# EAGLE design I2C_MUX (EAGLE 8.5.2)
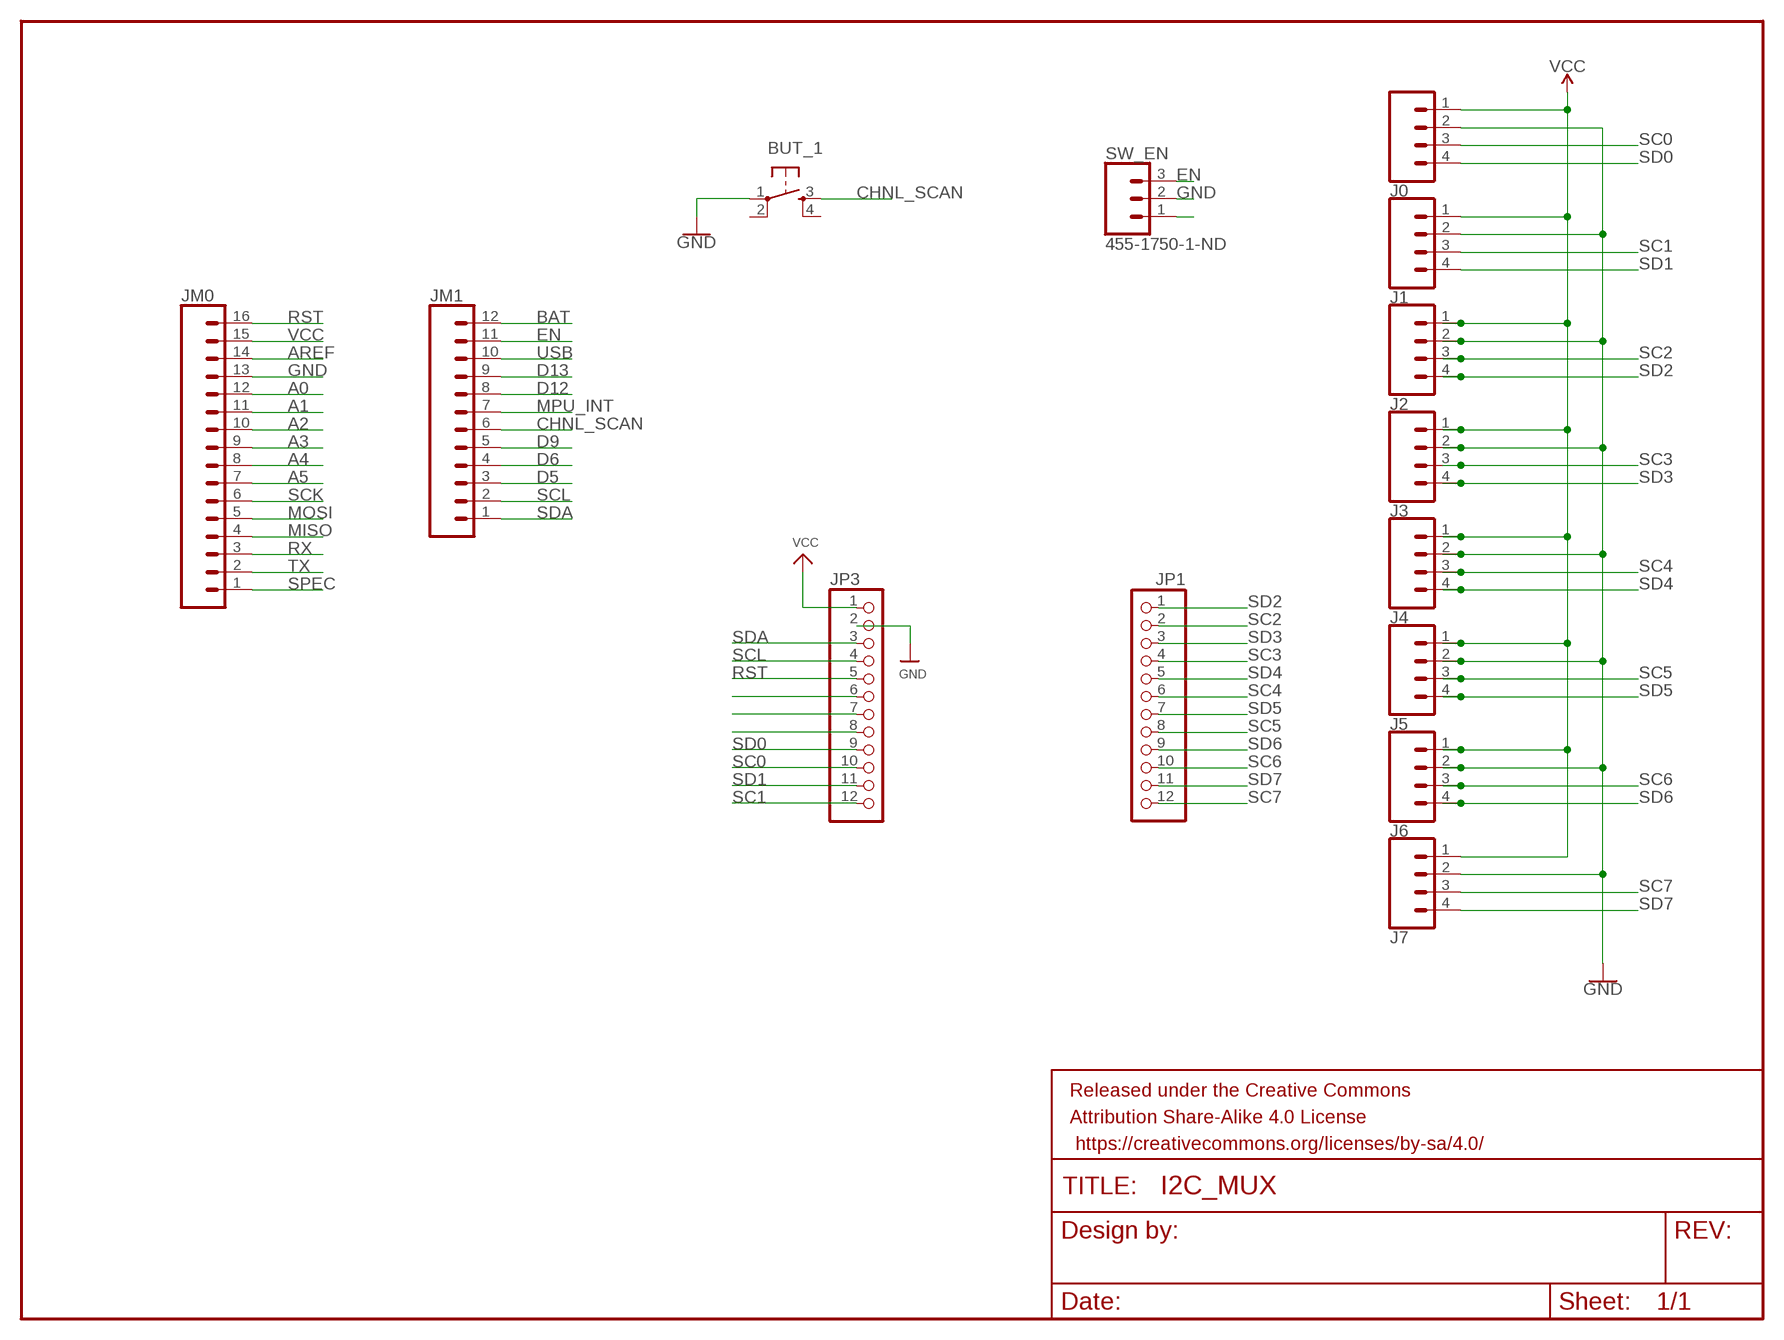
[diagram p0: schematic, sheet 1]

## Parts
BUT_1  TAC_SWITCHPTH  [TACTILE-PTH]
FRAME1  FRAME-LETTER  [CREATIVE_COMMONS]
J0  CONN_04POLAR  [MOLEX-1X4]
J1  CONN_04POLAR  [MOLEX-1X4]
J2  CONN_04POLAR  [MOLEX-1X4]
J3  CONN_04POLAR  [MOLEX-1X4]
J4  CONN_04POLAR  [MOLEX-1X4]
J5  CONN_04POLAR  [MOLEX-1X4]
J6  CONN_04POLAR  [MOLEX-1X4]
J7  CONN_04POLAR  [MOLEX-1X4]
JM0  CONN_16  [1X16]
JM1  CONN_12  [1X12]
JP1  HEADER-1X12  [1X12_ROUND]
JP3  HEADER-1X12  [1X12_ROUND]
SW_EN  455-1750-1-ND  CONN_03  [1X03]

## Nets
A0: JM0.12
A1: JM0.11
A2: JM0.10
A3: JM0.9
A4: JM0.8
A5: JM0.7
AREF: JM0.14
BAT: JM1.12
CHNL_SCAN: BUT_1.3 JM1.6
D5: JM1.3
D6: JM1.4
D9: JM1.5
D12: JM1.8
D13: JM1.9
EN: JM1.11 SW_EN.3
GND [ground]: BUT_1.1 J0.2 J1.2 J2.2 J3.2 J4.2 J5.2 J6.2 J7.2 JM0.13 JP3.2 SW_EN.2
MISO: JM0.4
MOSI: JM0.5
MPU_INT: JM1.7
N$3: SW_EN.1
N$5: JP3.6
N$6: JP3.7
N$7: JP3.8
RST: JM0.16 JP3.5
RX: JM0.3
SC0: J0.3 JP3.10
SC1: J1.3 JP3.12
SC2: J2.3 JP1.2
SC3: J3.3 JP1.4
SC4: J4.3 JP1.6
SC5: J5.3 JP1.8
SC6: J6.3 JP1.10
SC7: J7.3 JP1.12
SCK: JM0.6
SCL: JM1.2 JP3.4
SD0: J0.4 JP3.9
SD1: J1.4 JP3.11
SD2: J2.4 JP1.1
SD3: J3.4 JP1.3
SD4: J4.4 JP1.5
SD5: J5.4 JP1.7
SD6: J6.4 JP1.9
SD7: J7.4 JP1.11
SDA: JM1.1 JP3.3
SPEC: JM0.1
TX: JM0.2
USB: JM1.10
VCC: J0.1 J1.1 J2.1 J3.1 J4.1 J5.1 J6.1 J7.1 JM0.15 JP3.1
Unconnected: BUT_1.2 BUT_1.4

## Library data of the parts
BUT_1 = SparkFun-Retired:TAC_SWITCH: Momentary Switch Button commonly used for reset or general input. Spark Fun Electronics SKU : COM-00097 SMT- SWCH-08247
FRAME1 = SparkFun-Aesthetics:FRAME-LETTER: Schematic Frame - Letter Standard 8.5x11 US Letter frame
J0 J1-J7 = SparkFun-Connectors:CONN_04: Multi connection point. Often used as Generic Header-pin footprint for 0.1 inch spaced/style header connections On any of the 0.1 inch spaced packages, you can populate with these: Break Away Headers - Straight <https://www.sparkfun.com/products/116> (PRT-00116) Break Away Male Headers - Right Angle <https://www.sparkfun.com/products/553> (PRT-00553) Female Headers <https://www.sparkfun.com/products/115> (PRT-00115) Break Away Headers - Machine Pin <https://www.sparkfun.com/products/117> (PRT-00117) Break Away Female Headers - Swiss Machine Pin <https://www.sparkfun.com/products/743> (PRT-00743) For SCREWTERMINALS and SPRING TERMINALS visit here: Screw Terimnals on SparkFun.com <https://www.sparkfun.com/search/results?term=Screw+Terminals> (5mm/3.5mm/2.54mm spacing) This device is also useful as a general connection point to wire up your design to another part of your project. Our various solder wires solder well into these plated through hole pads. Hook-Up Wire - Assortment (Stranded, 22 AWG) <https://www.sparkfun.com/products/11375> (PRT-11375) Hook-Up Wire - Assortment (Solid Core, 22 AWG) <https://www.sparkfun.com/products/11367> (PRT-11367) View the entire wire category on our website here <https://www.sparkfun.com/categories/141> Special notes: Molex polarized connector foot print use with SKU : PRT-08231 with associated crimp pins and housings. 1MM SMD Version SKU: PRT-10208; PROD_ID: CONN-08186; SF_ID: PRT-08231
JM0 = SparkFun-Connectors:CONN_16: Multi connection point. Often used as Generic Header-pin footprint for 0.1 inch spaced/style header connections On any of the 0.1 inch spaced packages, you can populate with these: Break Away Headers - Straight <https://www.sparkfun.com/products/116> (PRT-00116) Break Away Male Headers - Right Angle <https://www.sparkfun.com/products/553> (PRT-00553) Female Headers <https://www.sparkfun.com/products/115> (PRT-00115) Break Away Headers - Machine Pin <https://www.sparkfun.com/products/117> (PRT-00117) Break Away Female Headers - Swiss Machine Pin <https://www.sparkfun.com/products/743> (PRT-00743) For SCREWTERMINALS and SPRING TERMINALS visit here: Screw Terimnals on SparkFun.com <https://www.sparkfun.com/search/results?term=Screw+Terminals> (5mm/3.5mm/2.54mm spacing) This device is also useful as a general connection point to wire up your design to another part of your project. Our various solder wires solder well into these plated through hole pads. Hook-Up Wire - Assortment (Stranded, 22 AWG) <https://www.sparkfun.com/products/11375> (PRT-11375) Hook-Up Wire - Assortment (Solid Core, 22 AWG) <https://www.sparkfun.com/products/11367> (PRT-11367) View the entire wire category on our website here <https://www.sparkfun.com/categories/141> Special notes: Molex polarized connector foot print use with SKU : PRT-08231 with associated crimp pins and housings. 1MM SMD Version SKU: PRT-10208 NOTES ON THE VARIANTS LOCK and LOCK_LONGPADS... This footprint was designed to help hold the alignment of a through-hole component (i.e. 6-pin header) while soldering it into place. You may notice that each hole has been shifted either up or down by 0.005 of an inch from it's more standard position (which is a perfectly straight line). This slight alteration caused the pins (the squares in the middle) to touch the edges of the holes. Because they are alternating, it causes a "brace" to hold the component in place. 0.005 has proven to be the perfect amount of "off-center" position when using our standard breakaway headers. Although looks a little odd when you look at the bare footprint, once you have a header in there, the alteration is very hard to notice. Also,if you push a header all the way into place, it is covered up entirely on the bottom side.
JM1 = SparkFun-Connectors:CONN_12: Multi connection point. Often used as Generic Header-pin footprint for 0.1 inch spaced/style header connections On any of the 0.1 inch spaced packages, you can populate with these: Break Away Headers - Straight <https://www.sparkfun.com/products/116> (PRT-00116) Break Away Male Headers - Right Angle <https://www.sparkfun.com/products/553> (PRT-00553) Female Headers <https://www.sparkfun.com/products/115> (PRT-00115) Break Away Headers - Machine Pin <https://www.sparkfun.com/products/117> (PRT-00117) Break Away Female Headers - Swiss Machine Pin <https://www.sparkfun.com/products/743> (PRT-00743) For SCREWTERMINALS and SPRING TERMINALS visit here: Screw Terimnals on SparkFun.com <https://www.sparkfun.com/search/results?term=Screw+Terminals> (5mm/3.5mm/2.54mm spacing) This device is also useful as a general connection point to wire up your design to another part of your project. Our various solder wires solder well into these plated through hole pads. Hook-Up Wire - Assortment (Stranded, 22 AWG) <https://www.sparkfun.com/products/11375> (PRT-11375) Hook-Up Wire - Assortment (Solid Core, 22 AWG) <https://www.sparkfun.com/products/11367> (PRT-11367) View the entire wire category on our website here <https://www.sparkfun.com/categories/141> Special notes: Molex polarized connector foot print use with SKU : PRT-08231 with associated crimp pins and housings. 1MM SMD Version SKU: PRT-10208 NOTES ON THE VARIANTS LOCK and LOCK_LONGPADS... This footprint was designed to help hold the alignment of a through-hole component (i.e. 6-pin header) while soldering it into place. You may notice that each hole has been shifted either up or down by 0.005 of an inch from it's more standard position (which is a perfectly straight line). This slight alteration caused the pins (the squares in the middle) to touch the edges of the holes. Because they are alternating, it causes a "brace" to hold the component in place. 0.005 has proven to be the perfect amount of "off-center" position when using our standard breakaway headers. Although looks a little odd when you look at the bare footprint, once you have a header in there, the alteration is very hard to notice. Also,if you push a header all the way into place, it is covered up entirely on the bottom side.
JP1 JP3 = microbuilder:HEADER-1X12
SW_EN = SparkFun-Connectors:CONN_03: Multi connection point. Often used as Generic Header-pin footprint for 0.1 inch spaced/style header connections On any of the 0.1 inch spaced packages, you can populate with these: Break Away Headers - Straight <https://www.sparkfun.com/products/116> (PRT-00116) Break Away Male Headers - Right Angle <https://www.sparkfun.com/products/553> (PRT-00553) Female Headers <https://www.sparkfun.com/products/115> (PRT-00115) Break Away Headers - Machine Pin <https://www.sparkfun.com/products/117> (PRT-00117) Break Away Female Headers - Swiss Machine Pin <https://www.sparkfun.com/products/743> (PRT-00743) Stackable Header - 3 Pin (Female, 0.1") <https://www.sparkfun.com/products/13875> (PRT-13875) For SCREWTERMINALS and SPRING TERMINALS visit here: Screw Terimnals on SparkFun.com <https://www.sparkfun.com/search/results?term=Screw+Terminals> (5mm/3.5mm/2.54mm spacing) This device is also useful as a general connection point to wire up your design to another part of your project. Our various solder wires solder well into these plated through hole pads. Hook-Up Wire - Assortment (Stranded, 22 AWG) <https://www.sparkfun.com/products/11375> (PRT-11375) Hook-Up Wire - Assortment (Solid Core, 22 AWG) <https://www.sparkfun.com/products/11367> (PRT-11367) View the entire wire category on our website here <https://www.sparkfun.com/categories/141> Special notes: Molex polarized connector foot print use with SKU : PRT-08232 with associated crimp pins and housings.; PROD_ID: XXX-00000

## Net classes
0 default: width 0.406 mm, clearance 0.205 mm
1 ground: width 0.61 mm

## Board
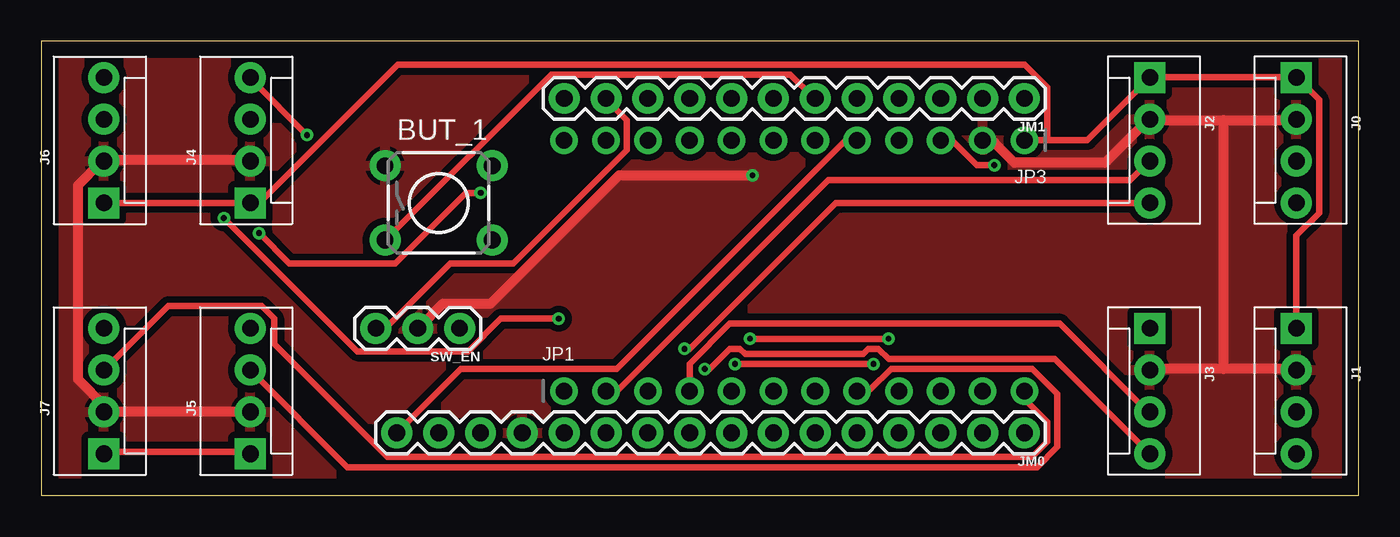
[diagram p1: board, top side]
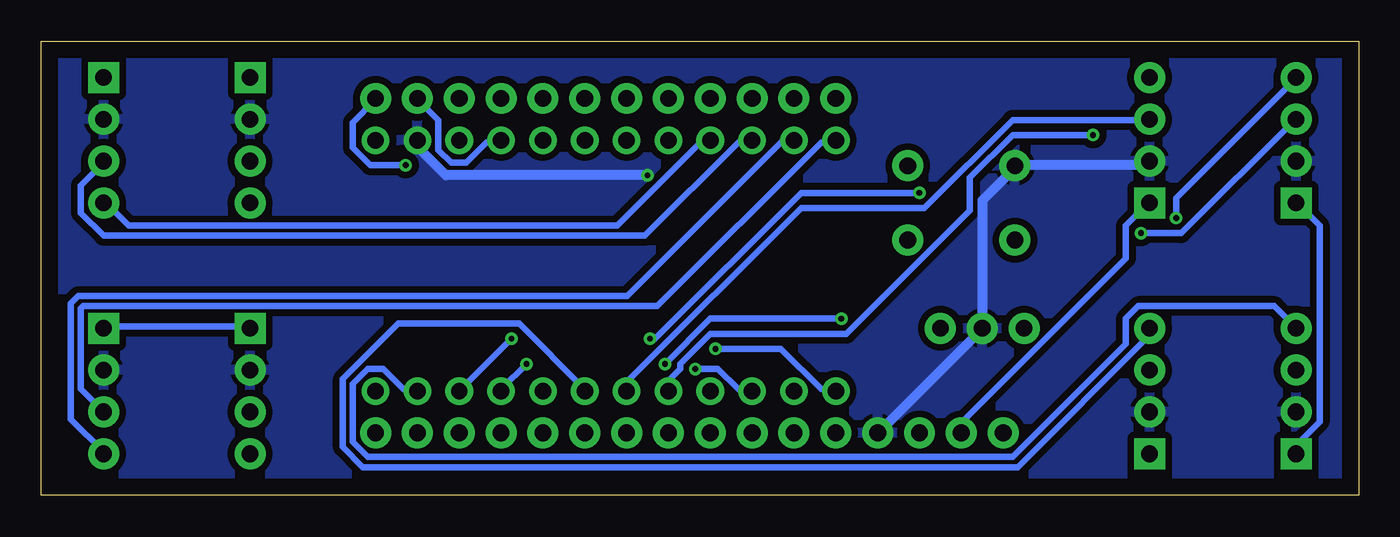
[diagram p2: board, bottom side, seen from below]

Size 79.99 x 27.61 mm. Coordinates in mm from the lower left corner, seen from the top.
Outline: 0,0 79.99,0 79.99,27.61 0,27.61 0,0
Copper layers (1*16): Top 0.035mm / dielectric 1.5mm / Bottom 0.035mm
Design rules "default": minimum track width 6mil, minimum drill 0.35mm, track to track 6mil, track to pad 6mil, pad to pad 6mil, via to via 6mil, smd to smd 6mil, copper to edge 40mil, drill to drill 6mil, minimum pad ring 10mil, minimum via ring 8mil, stop-mask expansion 4mil, vias tented up to drill 0mil, thermal gap 10mil

### Footprints (pad centres in the part's own frame; a part is rotated, then mirrored left to right if it is on the bottom)
TACTILE-PTH = drill 1.016 pad 1.88: 1 -3.251,2.261; 2 3.251,2.261; 3 -3.251,-2.261; 4 3.251,-2.261
MOLEX-1X4 = drill 1.016 pad 1.88 square: 1 0,0 | drill 1.016 pad 1.88: 2 2.54,0; 3 5.08,0; 4 7.62,0
1X16 = drill 1.016 pad 1.88: 1 0,0; 2 2.54,0; 3 5.08,0; 4 7.62,0; 5 10.16,0; 6 12.7,0; 7 15.24,0; 8 17.78,0; 9 20.32,0; 10 22.86,0; 11 25.4,0; 12 27.94,0; 13 30.48,0; 14 33.02,0; 15 35.56,0; 16 38.1,0
1X12 = drill 1.016 pad 1.88: 1 0,0; 2 2.54,0; 3 5.08,0; 4 7.62,0; 5 10.16,0; 6 12.7,0; 7 15.24,0; 8 17.78,0; 9 20.32,0; 10 22.86,0; 11 25.4,0; 12 27.94,0
1X12_ROUND = drill 1 pad 1.676: 1 -13.97,0; 2 -11.43,0; 3 -8.89,0; 4 -6.35,0; 5 -3.81,0; 6 -1.27,0; 7 1.27,0; 8 3.81,0; 9 6.35,0; 10 8.89,0; 11 11.43,0; 12 13.97,0
1X03 = drill 1.016 pad 1.88: 1 0,0; 2 2.54,0; 3 5.08,0

### Placement (x,y rotation side)
BUT_1  24.13,17.78 0 top
FRAME1  -73.66,12.7 0 top  (outside the outline)
J0  76.2,25.4 270 top
J1  76.2,10.16 270 top
J2  67.31,25.4 270 top
J3  67.31,10.16 270 top
J4  12.7,17.78 90 top
J5  12.7,2.54 90 top
J6  3.81,17.78 90 top
J7  3.81,2.54 90 top
JM0  59.69,3.81 180 top
JM1  59.69,24.13 180 top
JP1  45.72,6.35 0 top
JP3  45.72,21.59 180 top
SW_EN  25.4,10.16 180 top

### Tracks (layer width: path | path; a pad name or v marks a point on that pad's centre or on a via)
CHNL_SCAN
  Top 0.406: BUT_1.3 21.02,15.64 30.96,25.57 45.48,25.57 46.86,24.2 JM1.6
EN
  Top 0.406: SW_EN.3 20.41,10.29 21.02,10.29 24.84,14.11 28.67,14.11 35.54,20.99 35.54,22.82 34.32,24.04 JM1.11
GND  (via drill 0.35)
  Top 0.61: 71.77,7.69 76.05,7.69 J1.2 | 71.77,7.69 67.34,7.69 J3.2 | JP3.2 57.25,21.45 57.86,21.45 59.08,20.22 64.59,20.22 67.18,22.82 J2.2 67.49,22.82 71.77,22.82 | 71.77,22.82 76.05,22.82 J0.2 | 71.77,22.82 71.77,7.69 | J5.2 12.62,5.09 3.9,5.09 J7.2 3.9,5.4 2.22,7.08 2.22,18.85 3.6,20.22 J6.2 3.9,20.38 12.62,20.38 J4.2 | v43.19,19.46 35.09,19.46 27.29,11.66 24.39,11.66 23.01,10.29 SW_EN.2
  Bottom 0.61: JM0.13 29.12,3.87 22.86,10.13 SW_EN.2 22.86,10.44 22.86,17.93 21.02,19.77 BUT_1.1 20.87,20.07 12.92,20.07 12.77,20.22 J4.2 | v43.19,19.46 55.41,19.46 57.1,21.14 57.1,21.45 JP3.2
  pour Top (isolate 0.406): 1.27,27.94 1.27,0 80.01,0 80.01,27.94
  pour Bottom (isolate 0.406): 1.27,27.94 1.27,0 80.01,0 80.01,27.94
RST
  Top 0.406: JP3.5 49.45,21.45 48.69,21.45 34.93,7.69 25.46,7.69 21.63,3.87 JM0.16
SC0
  Bottom 0.406: JP3.10 36.92,21.45 37.68,21.45 43.34,15.79 76.2,15.79 77.58,17.17 77.58,18.85 76.2,20.22 J0.3
SC1
  Bottom 0.406: JP3.12 31.88,21.45 32.64,21.45 42.58,11.51 77.42,11.51 77.58,11.36 77.58,6.47 76.2,5.09 J1.3
SC2
  Top 0.406: JP1.2 34.32,6.47 35.09,6.47 47.77,19.15 66.11,19.15 67.18,20.22 J2.3
SC3
  Top 0.406: JP1.4 39.37,6.47 39.37,7.99 41.81,10.44 61.84,10.44 67.18,5.09 J3.3
SC4
  Bottom 0.406: JP1.6 44.41,6.47 44.41,6.93 33.86,17.47 26.37,17.47 21.02,22.82 12.77,22.82 J4.3
SC5
  Top 0.406: JP1.8 49.61,6.47 50.37,6.47 51.59,7.69 60.15,7.69 61.68,6.16 61.68,2.95 60.46,1.73 18.58,1.73 12.77,7.54 J5.3
SC6  (via drill 0.35)
  Top 0.406: v43.03,9.52 v51.44,9.52 | v26.68,18.39 25.76,18.39 21.48,14.11 15.06,14.11 v13.23,15.94
  Bottom 0.406: v51.44,9.52 54.5,6.47 JP1.10 | v43.03,9.52 42.73,9.52 33.86,18.39 v26.68,18.39 | v13.23,15.94 10.78,15.94 3.9,22.82 J6.3
SC7
  Top 0.406: JP1.12 59.7,6.31 59.7,5.86 61.07,4.48 61.07,3.26 60.15,2.34 21.02,2.34 14.14,9.22 14.14,10.75 13.38,11.51 7.73,11.51 3.9,7.69 J7.3
SCL
  Bottom 0.406: JP3.4 52.2,21.45 52.97,21.45 54.19,20.22 55.11,20.22 55.87,20.99 55.87,22.82 57.1,24.04 JM1.2
SD0
  Bottom 0.406: JP3.9 39.52,21.45 39.98,21.45 45.02,16.4 74.67,16.4 76.05,17.78 J0.4
SD1
  Bottom 0.406: JP3.11 34.32,21.45 35.09,21.45 44.41,12.12 77.73,12.12 78.19,11.66 78.19,4.63 76.2,2.65 J1.4
SD2  (via drill 0.35)
  Top 0.406: v39.06,8.91 39.37,8.91 48.23,17.78 67.18,17.78 J2.4
  Bottom 0.406: v39.06,8.91 35.09,8.91 32.64,6.47 31.88,6.47 JP1.1
SD3  (via drill 0.35)
  Top 0.406: v40.28,7.69 40.59,7.69 41.81,8.91 42.42,8.91 42.73,8.61 49.91,8.61 50.22,8.91 50.83,8.91 51.44,8.3 61.53,8.3 67.18,2.65 J3.4
  Bottom 0.406: v40.28,7.69 38.91,7.69 37.68,6.47 36.92,6.47 JP1.3
SD4  (via drill 0.35)
  Top 0.406: v16.13,21.91 12.77,25.27 J4.4
  Bottom 0.406: v16.13,21.91 21.02,21.91 23.62,19.31 23.62,17.32 31.11,9.83 39.37,9.83 41.2,7.99 41.2,7.69 41.81,7.08 41.81,6.47 JP1.5
SD5
  Bottom 0.406: JP1.7 47.01,6.47 50.98,10.44 58.32,10.44 61.68,7.08 61.68,2.95 60.46,1.73 20.72,1.73 12.77,9.68 12.77,10.13 J5.4
SD6  (via drill 0.35)
  Top 0.406: v42.12,7.99 v50.52,7.99 | v31.42,10.75 27.9,10.75 25.91,8.76 19.19,8.76 v11.09,16.86
  Bottom 0.406: v50.52,7.99 52.05,6.47 JP1.9 | v42.12,7.99 39.37,10.75 v31.42,10.75 | v11.09,16.86 11.09,18.08 3.9,25.27 J6.4
SD7
  Bottom 0.406: JP1.11 57.25,6.47 58.01,6.47 59.24,7.69 60.15,7.69 61.07,6.77 61.07,3.26 60.15,2.34 21.02,2.34 14.14,9.22 14.14,10.75 13.38,11.51 5.13,11.51 3.9,10.29 J7.4
SDA  (via drill 0.35)
  Top 0.406: v57.86,20.07 56.79,20.07 55.41,21.45 54.65,21.45 JP3.3
  Bottom 0.406: v57.86,20.07 60,20.07 61.07,21.14 61.07,22.67 59.7,24.04 JM1.1
VCC
  Top 0.406: 61.07,21.6 63.52,21.6 67.18,25.27 J2.1 67.49,25.42 76.05,25.42 J0.1 76.35,25.27 77.58,24.04 77.58,17.17 76.2,15.79 76.2,10.29 J1.1 | 61.07,21.6 JP3.1 | J7.1 3.9,2.65 12.62,2.65 J5.1 | J6.1 3.9,17.78 12.62,17.78 J4.1 12.77,17.93 13.38,17.93 21.63,26.18 59.7,26.18 61.07,24.81 61.07,21.6
  Bottom 0.406: J3.1 67.34,10.29 76.05,10.29 J1.1 | JM0.15 24.08,3.87 24.08,4.48 14.14,14.41 14.14,16.4 12.77,17.78 J4.1 | J7.1 3.75,2.65 3.75,3.1 2.38,4.48 2.38,16.4 3.75,17.78 J6.1